# EAGLE design TRAFO-01 (EAGLE 5.05)
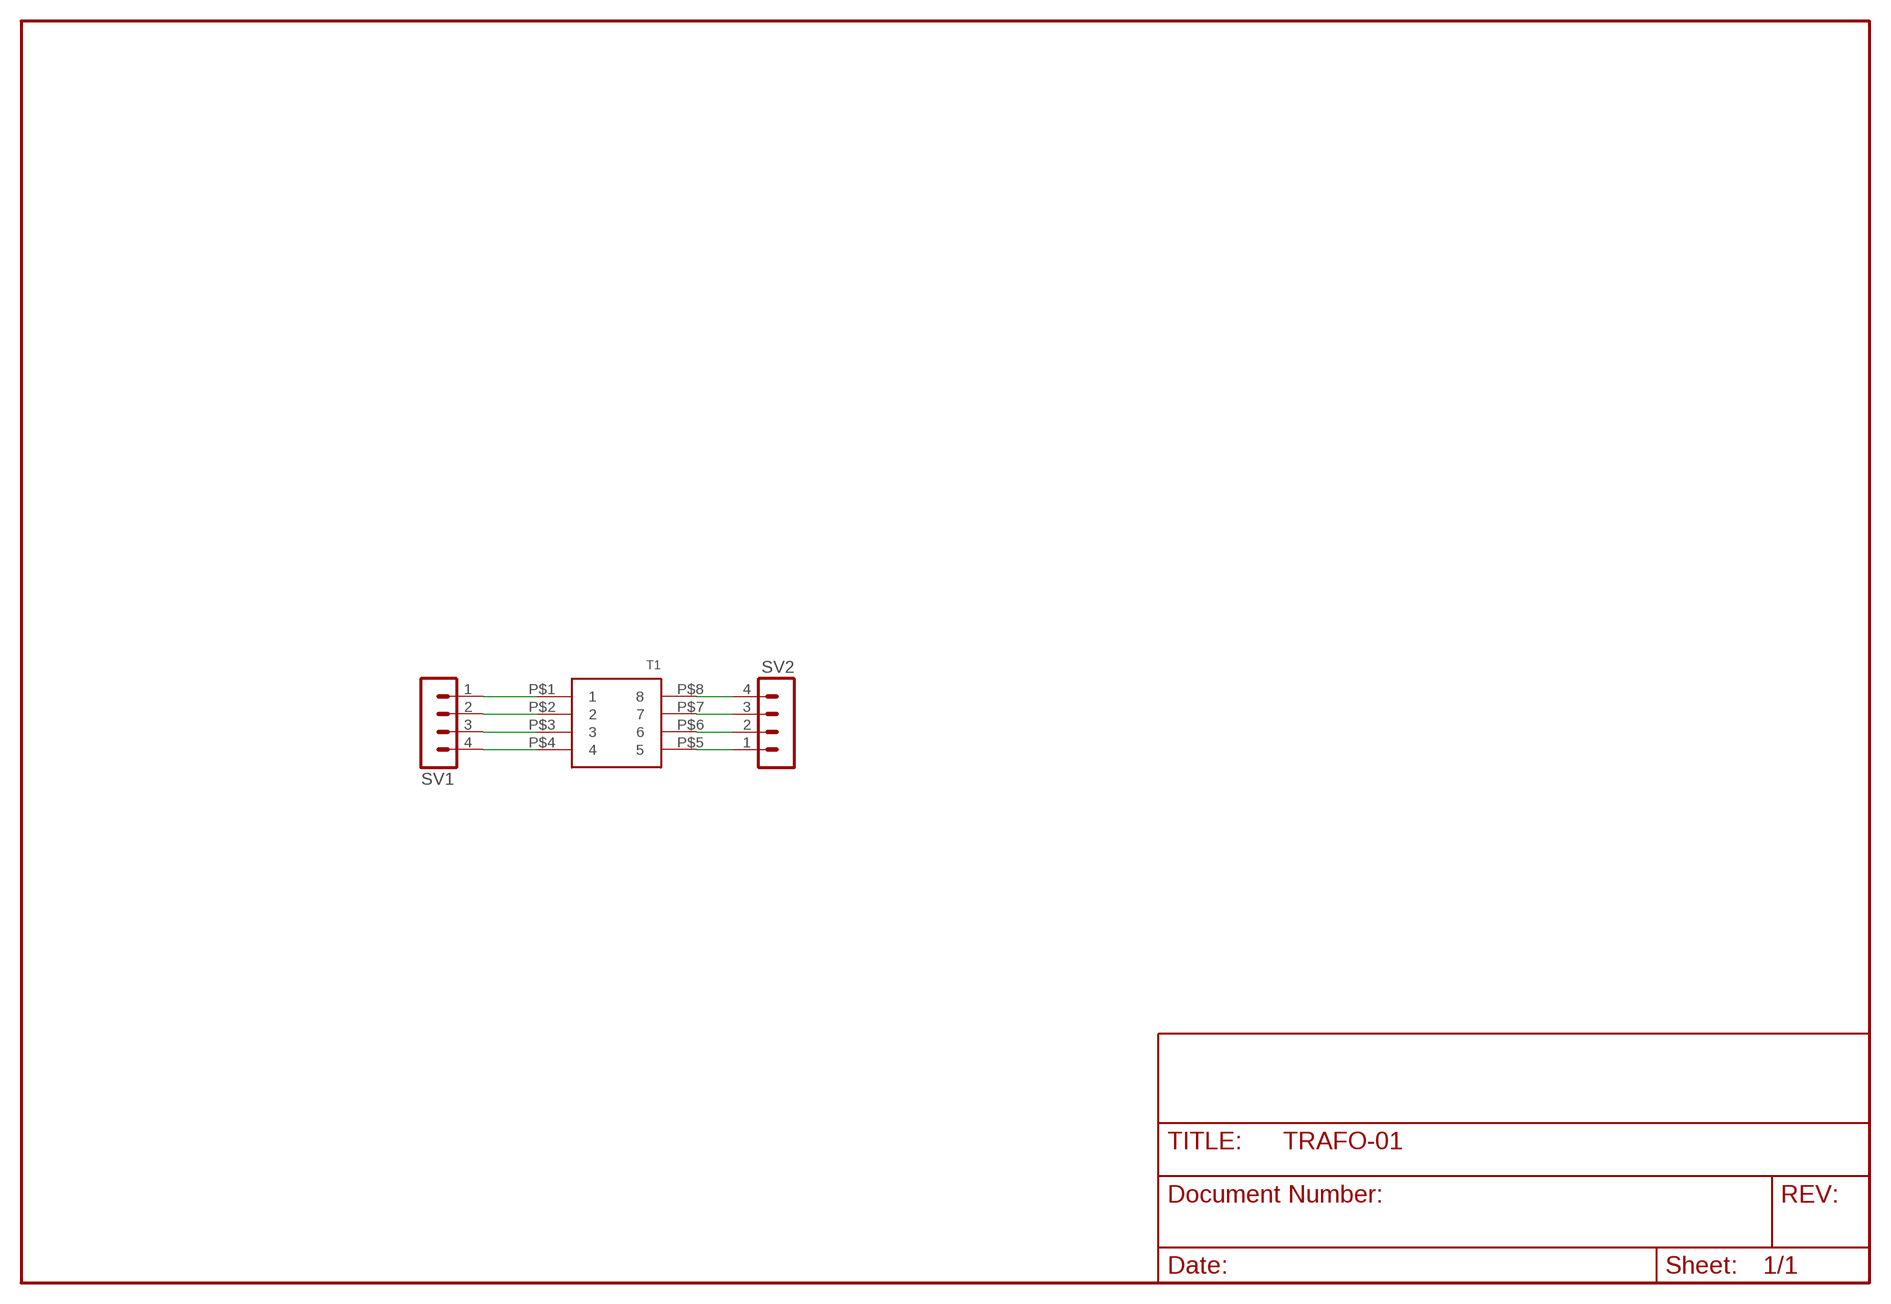
[diagram p0: schematic, sheet 1]

## Parts
SV1  MA04-1  [MA04-1]
SV2  MA04-1  [MA04-1]
T1  TRAFO-8  [EFD12]

## Nets
N$1: SV1.1 T1.P$1
N$2: SV1.2 T1.P$2
N$3: SV1.3 T1.P$3
N$4: SV1.4 T1.P$4
N$5: SV2.1 T1.P$5
N$6: SV2.2 T1.P$6
N$7: SV2.3 T1.P$7
N$8: SV2.4 T1.P$8

## Library data of the parts
SV1 SV2 = con-lstb:MA04-1: PIN HEADER
T1 = turbod3:TRAFO-8

## Board
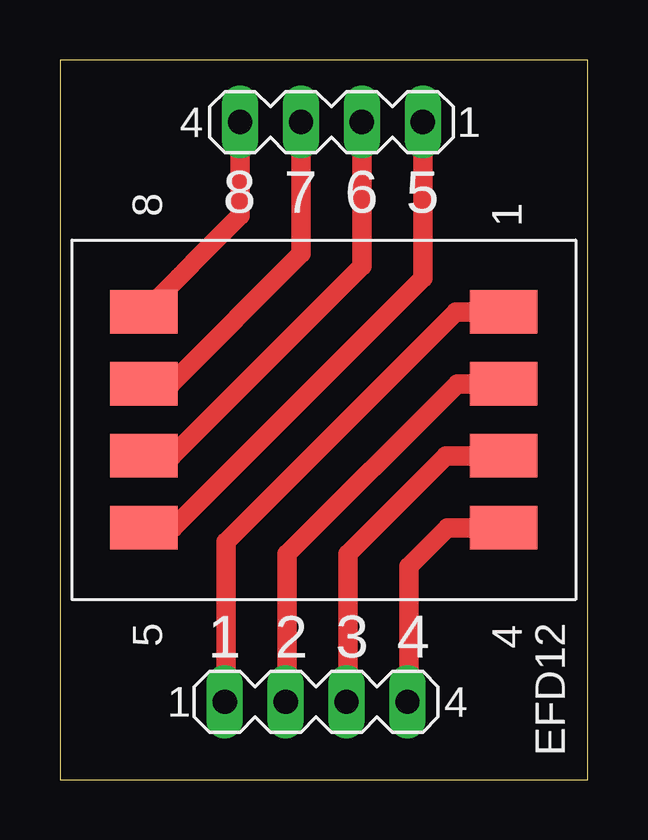
[diagram p1: board, top side]
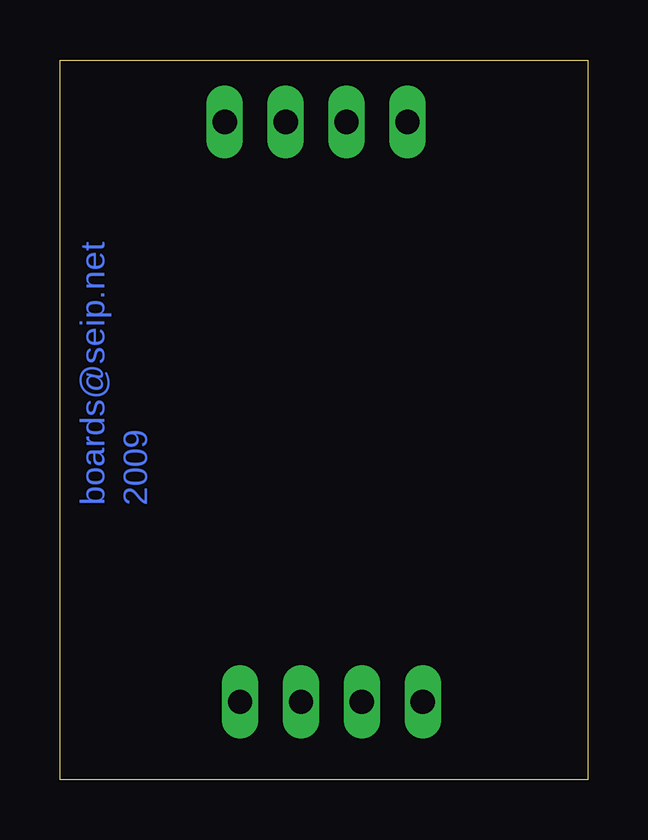
[diagram p2: board, bottom side, seen from below]

Size 22 x 30 mm. Coordinates in mm from the lower left corner, seen from the top.
Outline: 0,0 22,0 22,30 0,30 0,0
Copper layers (1*16): Top 0.035mm / dielectric 1.5mm / Bottom 0.035mm
Design rules "default": minimum track width 10mil, minimum drill 24mil, track to track 8mil, track to pad 8mil, pad to pad 8mil, via to via 8mil, smd to smd 8mil, copper to edge 40mil, drill to drill 8mil, minimum pad ring 10mil, minimum via ring 8mil, stop-mask expansion 4mil, vias tented up to drill 0mil, thermal gap 10mil

### Footprints (pad centres in the part's own frame; a part is rotated, then mirrored left to right if it is on the bottom)
MA04-1 = drill 1.016 long: 1 -3.81,0; 2 -1.27,0; 3 1.27,0; 4 3.81,0
EFD12 = smd 1.8 x 2.8: P$1 -4.5,7.5; P$2 -1.5,7.5; P$3 1.5,7.5; P$4 4.5,7.5; P$5 4.5,-7.5; P$6 1.5,-7.5; P$7 -1.5,-7.5; P$8 -4.5,-7.5

### Placement (x,y rotation side)
SV1  10.68,3.24 0 top
SV2  11.32,27.41 180 top
T1  11,15 270 top

### Tracks (layer width: path | path; a pad name or v marks a point on that pad's centre or on a via)
N$1
  Top 0.813: T1.P$1 16.52,19.5 6.92,9.91 6.92,3.29 SV1.1
N$2
  Top 0.813: T1.P$2 16.56,16.5 9.46,9.4 9.46,3.29 SV1.2
N$3
  Top 0.813: T1.P$3 16.1,13.5 12,9.4 12,3.29 SV1.3
N$4
  Top 0.813: T1.P$4 16.15,10.5 14.54,8.89 14.54,3.29 SV1.4
N$5
  Top 0.813: T1.P$5 4.72,10.5 15.13,20.91 SV2.1
N$6
  Top 0.813: T1.P$6 4.67,13.5 12.59,21.42 SV2.2
N$7
  Top 0.813: T1.P$7 4.63,16.5 10.05,21.92 SV2.3
N$8
  Top 0.813: T1.P$8 7.51,23.51 SV2.4

### Text on the board
Bottom: 2009 | boards@seip.net
tNames: 8 | 7 | 6 | 5 | EFD12 | 1 | 2 | 3 | 4